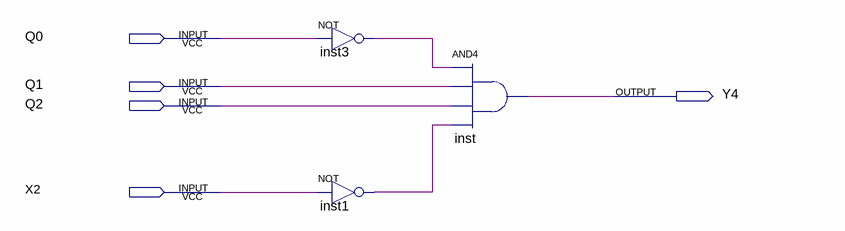
[diagram p0: schematic sheet]
// Quartus schematic Y4.bdf as structural Verilog: 3 symbols, 5 pins
module Y4 (
  input  Q0,
  input  Q1,
  input  Q2,
  input  X2,
  output Y4
);

  wire inst1_out, inst3_out;

  not inst3 (inst3_out, Q0);
  not inst1 (inst1_out, X2);
  and inst (Y4, inst3_out, Q1, Q2, inst1_out);
endmodule
